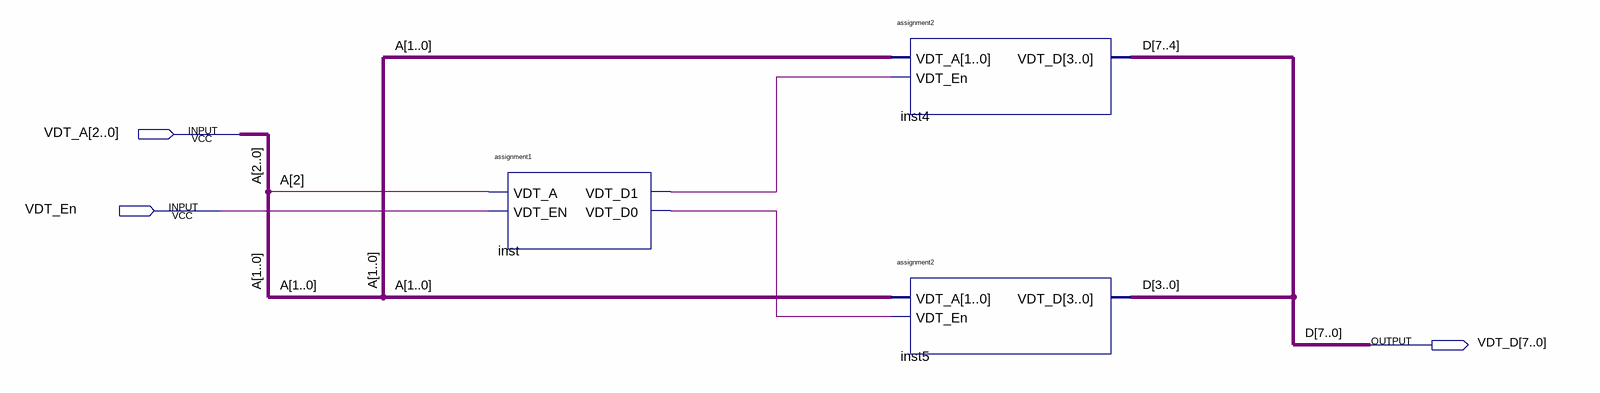
[diagram p0: schematic sheet]
// Quartus schematic assignment3.bdf as structural Verilog: 3 symbols, 3 pins
module assignment3 (
  input  [2:0] VDT_A,
  input  VDT_En,
  output [7:0] VDT_D
);

  wire inst_vdt_d0, inst_vdt_d1;

  assignment1 inst (.VDT_A(VDT_A[2]), .VDT_EN(VDT_En), .VDT_D1(inst_vdt_d1), .VDT_D0(inst_vdt_d0));
  assignment2 inst4 (.VDT_A(VDT_A[1:0]), .VDT_En(inst_vdt_d1), .VDT_D(VDT_D[7:4]));
  assignment2 inst5 (.VDT_A(VDT_A[1:0]), .VDT_En(inst_vdt_d0), .VDT_D(VDT_D[3:0]));

  // Other names for the same wires on the sheet: D[7:0] = VDT_D; A[2:0] = VDT_A
endmodule
